# EAGLE design divchrono-master (EAGLE 7.5.0)
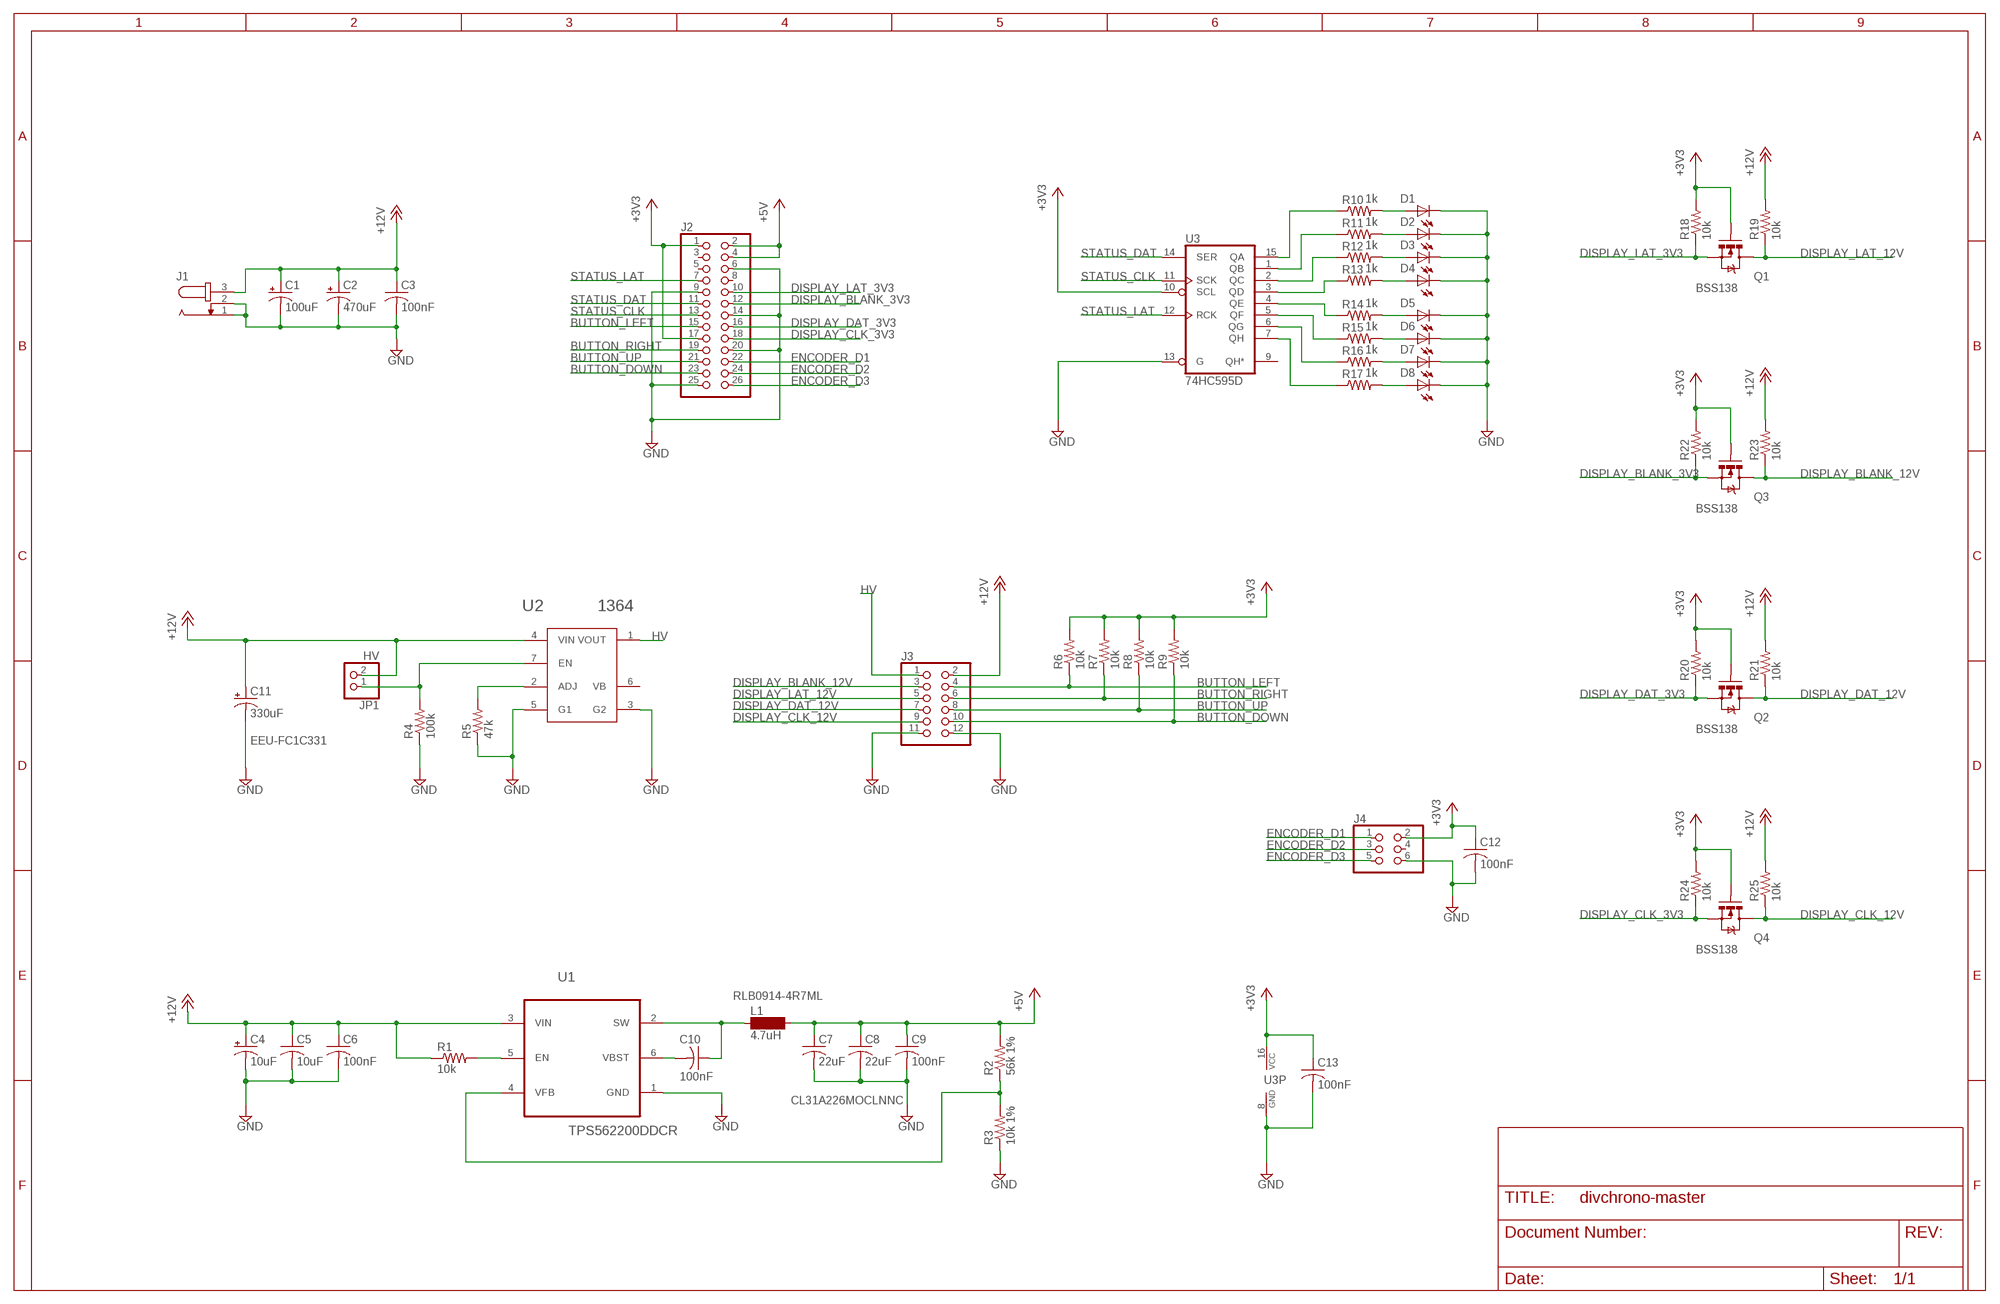
[diagram p0: schematic, sheet 1]

## Parts
C1  100uF  CPOL-USE2.5-6  [E2,5-6]
C2  470uF  CPOL-USE2.5-6  [E2,5-6]
C3  100nF  C-USC1206  [C1206]
C4  10uF  CPOL-USE2-5  [E2-5]
C5  10uF  C-USC1206  [C1206]
C6  100nF  C-USC1206  [C1206]
C7  22uF  C-USC1206  [C1206]
C8  22uF  C-USC1206  [C1206]
C9  100nF  C-USC1206  [C1206]
C10  100nF  C-USC1206  [C1206]
C11  330uF  CPOL-USE3.5-8  [E3,5-8]
C12  100nF  C-USC1206  [C1206]
C13  100nF  C-USC1206  [C1206]
D1  LEDCHIPLED_1206  [CHIPLED_1206]
D2  LEDCHIPLED_1206  [CHIPLED_1206]
D3  LEDCHIPLED_1206  [CHIPLED_1206]
D4  LEDCHIPLED_1206  [CHIPLED_1206]
D5  LEDCHIPLED_1206  [CHIPLED_1206]
D6  LEDCHIPLED_1206  [CHIPLED_1206]
D7  LEDCHIPLED_1206  [CHIPLED_1206]
D8  LEDCHIPLED_1206  [CHIPLED_1206]
J1  JACK-PLUG0  [SPC4077]
J2  PINHD-2X13  [2X13]
J3  PINHD-2X6  [2X06]
J4  PINHD-2X3  [2X03]
JP1  HV  PINHD-1X2  [1X02]
L1  4.7uH  BS11  [BS11]
Q1  BSS138  MOSFET-NCHANNELBSS138  [SOT23-3]
Q2  BSS138  MOSFET-NCHANNELBSS138  [SOT23-3]
Q3  BSS138  MOSFET-NCHANNELBSS138  [SOT23-3]
Q4  BSS138  MOSFET-NCHANNELBSS138  [SOT23-3]
R1  10k  R-US_R1206  [R1206]
R2  56k 1%  R-US_R1206  [R1206]
R3  10k 1%  R-US_R1206  [R1206]
R4  100k  R-US_R1206  [R1206]
R5  47k  R-US_R1206  [R1206]
R6  10k  R-US_R1206  [R1206]
R7  10k  R-US_R1206  [R1206]
R8  10k  R-US_R1206  [R1206]
R9  10k  R-US_R1206  [R1206]
R10  1k  R-US_R1206  [R1206]
R11  1k  R-US_R1206  [R1206]
R12  1k  R-US_R1206  [R1206]
R13  1k  R-US_R1206  [R1206]
R14  1k  R-US_R1206  [R1206]
R15  1k  R-US_R1206  [R1206]
R16  1k  R-US_R1206  [R1206]
R17  1k  R-US_R1206  [R1206]
R18  10k  R-US_R1206  [R1206]
R19  10k  R-US_R1206  [R1206]
R20  10k  R-US_R1206  [R1206]
R21  10k  R-US_R1206  [R1206]
R22  10k  R-US_R1206  [R1206]
R23  10k  R-US_R1206  [R1206]
R24  10k  R-US_R1206  [R1206]
R25  10k  R-US_R1206  [R1206]
U1  TPS562200DDCR  [SOT95P280X110-6N]
U2  1364  [1364]
U3  74HC595D  [SO16]

## Nets
+3V3: C12.1 C13.1 J2.1 J2.17 J4.2 Q1.1(G) Q2.1(G) Q3.1(G) Q4.1(G) R6.2 R7.2 R8.2 R9.2 R18.2 R20.2 R22.2 R24.2 U3.10(SCL) U3.16(VCC)
+5V: C7.1 C8.1 C9.1 J2.2 J2.4 L1.2 R2.2
+12V: C1.+ C2.+ C3.1 C4.+ C5.1 C6.1 C11.+ J1.3 J3.2 JP1.2 R1.1 R19.2 R21.2 R23.2 R25.2 U1.3(VIN) U2.4(VIN)
BUTTON_DOWN: J2.23 J3.10 R9.1
BUTTON_LEFT: J2.15 J3.4 R6.1
BUTTON_RIGHT: J2.19 J3.6 R7.1
BUTTON_UP: J2.21 J3.8 R8.1
DISPLAY_BLANK_3V3: J2.12 Q3.2(S) R22.1
DISPLAY_BLANK_12V: J3.3 Q3.3(D) R23.1
DISPLAY_CLK_3V3: J2.18 Q4.2(S) R24.1
DISPLAY_CLK_12V: J3.9 Q4.3(D) R25.1
DISPLAY_DAT_3V3: J2.16 Q2.2(S) R20.1
DISPLAY_DAT_12V: J3.7 Q2.3(D) R21.1
DISPLAY_LAT_3V3: J2.10 Q1.2(S) R18.1
DISPLAY_LAT_12V: J3.5 Q1.3(D) R19.1
ENCODER_D1: J2.22 J4.1
ENCODER_D2: J2.24 J4.3
ENCODER_D3: J2.26 J4.5
GND: C1.- C2.- C3.2 C4.- C5.2 C6.2 C7.2 C8.2 C9.2 C11.- C12.2 C13.2 D1.C D2.C D3.C D4.C D5.C D6.C D7.C D8.C J1.1 J1.2 J2.6 J2.9 J2.14 J2.20 J2.25 J3.11 J3.12 J4.6 R3.1 R4.1 R5.1 U1.1(GND) U2.3(G2) U2.5(G1) U3.8(GND) U3.13(G)
HV: J3.1 U2.1(VOUT)
N$1: R1.2 U1.5(EN)
N$2: C10.1 L1.1 U1.2(SW)
N$3: JP1.1 R4.2 U2.7(EN)
N$4: R5.2 U2.2(ADJ)
N$5: C10.2 U1.6(VBST)
N$6: R2.1 R3.2 U1.4(VFB)
N$7: R14.1 U3.4(QE)
N$8: R13.1 U3.3(QD)
N$9: R12.1 U3.2(QC)
N$10: D8.A R17.2
N$11: D7.A R16.2
N$12: D6.A R15.2
N$13: D5.A R14.2
N$14: R11.1 U3.1(QB)
N$15: R10.1 U3.15(QA)
N$16: R15.1 U3.5(QF)
N$17: R16.1 U3.6(QG)
N$18: R17.1 U3.7(QH)
N$19: D4.A R13.2
N$20: D3.A R12.2
N$21: D2.A R11.2
N$22: D1.A R10.2
STATUS_CLK: J2.13 U3.11(SCK)
STATUS_DAT: J2.11 U3.14(SER)
STATUS_LAT: J2.7 U3.12(RCK)
Unconnected: J2.3 J2.5 J2.8 J4.4 U2.6(VB) U3.9(QH*)

## Notes on the sheet
- EEU-FC1C331
- RLB0914-4R7ML
- CL31A226MOCLNNC

## Library data of the parts
C1 C2 C4 C11 = rcl:CPOL-US: POLARIZED CAPACITOR, American symbol
C3 C5-C10 C12 C13 = rcl:C-US: CAPACITOR, American symbol
D1-D8 = led:LED: LED OSRAM: - CHIPLED LG R971, LG N971, LY N971, LG Q971, LY Q971, LO R971, LY R971 LH N974, LH R974 LS Q976, LO Q976, LY Q976 LO Q996 - Hyper CHIPLED LW Q18S LB Q993, LB Q99A, LB R99A - SideLED LS A670, LO A670, LY A670, LG A670, LP A670 LB A673, LV A673, LT A673, LW A673 LH A674 LY A675 LS A676, LA A676, LO A676, LY A676, LW A676 LS A679, LY A679, LG A679 - Hyper Micro SIDELED® LS Y876, LA Y876, LO Y876, LY Y876 LT Y87S - SmartLED LW L88C, LW L88S LB L89C, LB L89S, LG L890 LS L89K, LO L89K, LY L89K LS L896, LA L896, LO L896, LY L896 - TOPLED LS T670, LO T670, LY T670, LG T670, LP T670 LSG T670, LSP T670, LSY T670, LOP T670, LYG T670 LG T671, LOG T671, LSG T671 LB T673, LV T673, LT T673, LW T673 LH T674 LS T676, LA T676, LO T676, LY T676, LB T676, LH T676, LSB T676, LW T676 LB T67C, LV T67C, LT T67C, LS T67K, LO T67K, LY T67K, LW E67C LS E67B, LA E67B, LO E67B, LY E67B, LB E67C, LV E67C, LT E67C LW T67C LS T679, LY T679, LG T679 LS T770, LO T770, LY T770, LG T770, LP T770 LB T773, LV T773, LT T773, LW T773 LH T774 LS E675, LA E675, LY E675, LS T675 LS T776, LA T776, LO T776, LY T776, LB T776 LHGB T686 LT T68C, LB T68C - Hyper Mini TOPLED® LB M676 - Mini TOPLED Santana® LG M470 LS M47K, LO M47K, LY M47K Source: http://www.osram.convergy.de LUXEON: - LUMILED® LXK2-PW12-R00, LXK2-PW12-S00, LXK2-PW14-U00, LXK2-PW14-V00 LXK2-PM12-R00, LXK2-PM12-S00, LXK2-PM14-U00 LXK2-PE12-Q00, LXK2-PE12-R00, LXK2-PE12-S00, LXK2-PE14-T00, LXK2-PE14-U00 LXK2-PB12-K00, LXK2-PB12-L00, LXK2-PB12-M00, LXK2-PB14-N00, LXK2-PB14-P00, LXK2-PB14-Q00 LXK2-PR12-L00, LXK2-PR12-M00, LXK2-PR14-Q00, LXK2-PR14-R00 LXK2-PD12-Q00, LXK2-PD12-R00, LXK2-PD12-S00 LXK2-PH12-R00, LXK2-PH12-S00 LXK2-PL12-P00, LXK2-PL12-Q00, LXK2-PL12-R00 Source: www.luxeon.com KINGBRIGHT: KA-3528ASYC Source: www.kingbright.com
J1 = con-jack:JACK-PLUG: DC POWER JACK Power Jack, DC, Right Angle, Through Hole, Rated 5A at 16VDC, PC Terminals Distributor: Farnell (www.Farnell.de) Drawing: 84N1161.pdf / 84N1162.pdf Manufacturer: SPC Technology (www.spctechnology.com) Type: SPC4077 / SPC 4078; OC_FARNELL: unknown; OC_NEWARK: unknown
J2 = pinhead:PINHD-2X13: PIN HEADER
J3 = pinhead:PINHD-2X6: PIN HEADER
J4 = pinhead:PINHD-2X3: PIN HEADER
JP1 = pinhead:PINHD-1X2: PIN HEADER
L1 = inductor-neosid:BS: INDUCTOR nominal inductance, magnetically screened; OC_FARNELL: unknown; OC_NEWARK: unknown
Q1-Q4 = SparkFun-DiscreteSemi:MOSFET-NCHANNEL: Common NMOSFET Parts MFG P/N Store ID Prod ID FDD8780 TRANS-09984 SI7820DN TRANS-11055 FDS6630A IC-08089 2N7002PW TRANS-11151 FQP30N06L COM-10213 TRANS-10060 BSS123LT1G TRANS-08345 BSS138 TRANS-00830 BS170 2N7000; PROD_ID: TRANS-00830; VALUE: 200mA/50V
R1-R25 = rcl:R-US_: RESISTOR, American symbol
U1 = divchrono:TPS562200DDCR
U2 = TES:1364: TES1364 HVPS Horizontal module
U3 = 74xx-eu:74*595: 8-bit SHIFT REGISTER, output latch

## Board
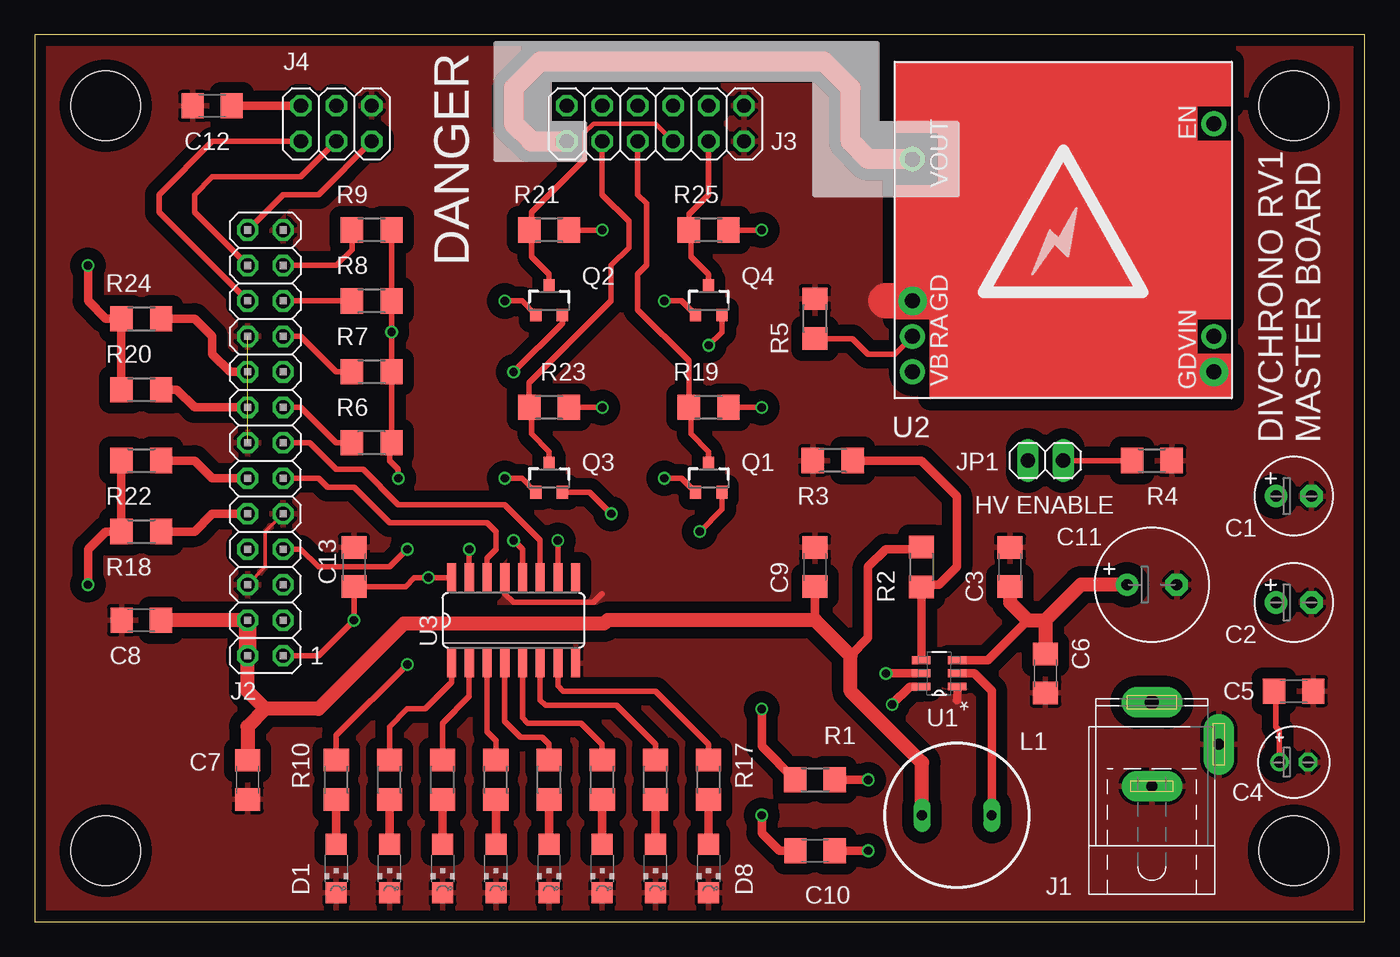
[diagram p1: board, top side]
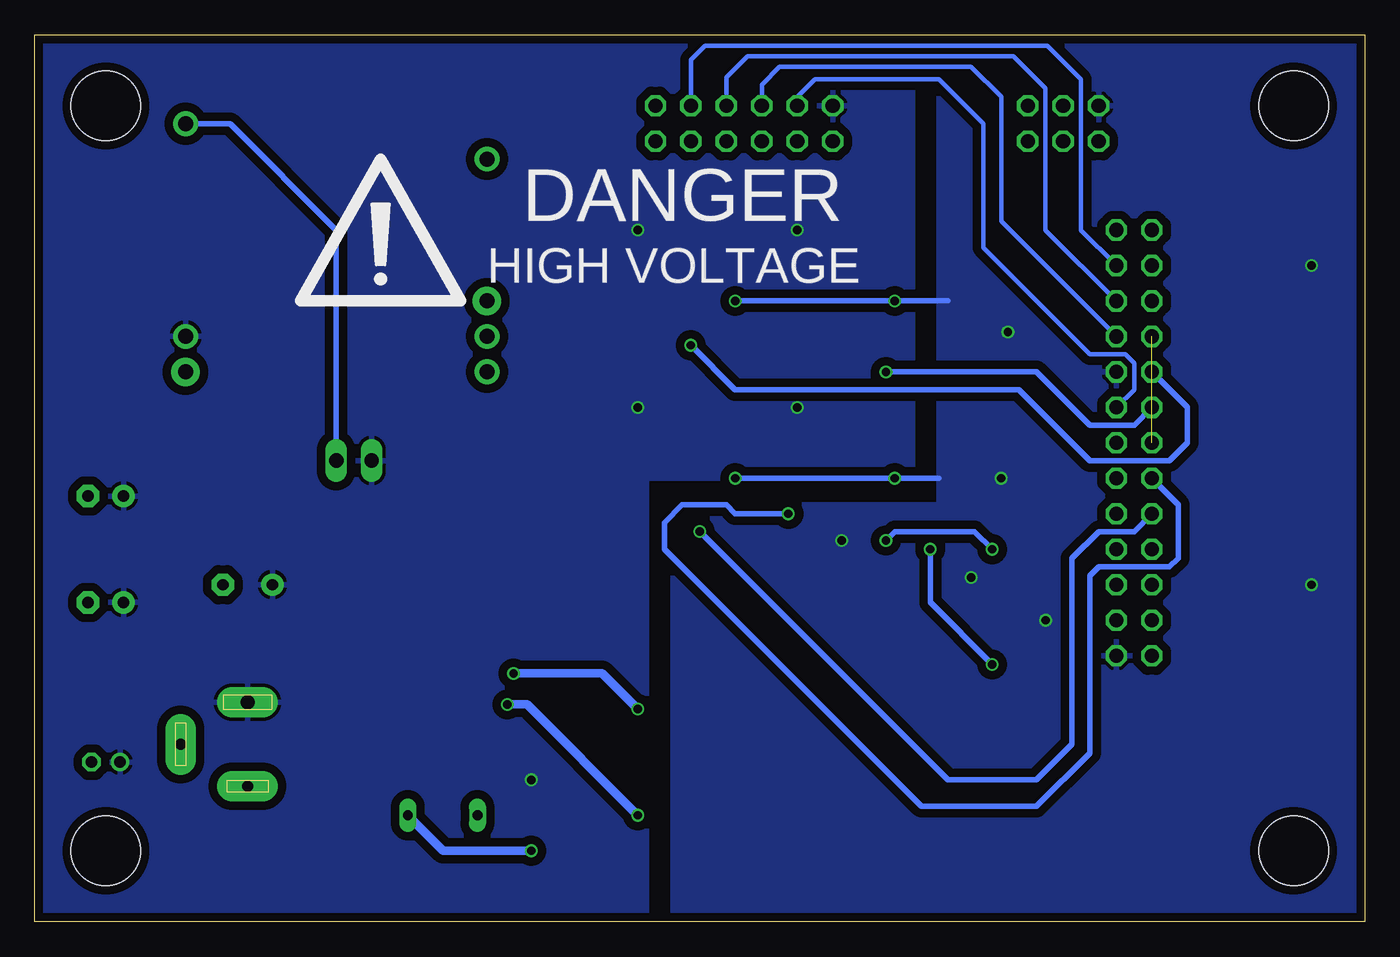
[diagram p2: board, bottom side, seen from below]

Size 95.25 x 63.5 mm. Coordinates in mm from the lower left corner, seen from the top.
Outline: 0,0 95.25,0 95.25,63.5 0,63.5 0,0
Copper layers (1*16): Top 0.035mm / dielectric 1.5mm / Bottom 0.035mm
Design rules "dirt_cheap_dirty_boards.v1 *": minimum track width 5mil, minimum drill 12mil, track to track 12mil, track to pad 12mil, pad to pad 12mil, via to via 12mil, smd to smd 12mil, copper to edge 10mil, drill to drill 10mil, minimum pad ring 10mil, minimum via ring 6mil, stop-mask expansion 2mil, vias tented up to drill 25mil, thermal gap 10mil
Holes 4.98 mm at 5.08,58.42 5.08,5.08 90.17,58.42 90.17,5.08

### Footprints (pad centres in the part's own frame; a part is rotated, then mirrored left to right if it is on the bottom)
E2,5-6 = drill 0.813 pad 1.6: + -1.27,0 | drill 0.813 pad 1.6 octagon: - 1.27,0
C1206 = smd 1.6 x 1.8: 1 -1.4,0; 2 1.4,0
E2-5 = drill 0.813 pad 1.27: + -1.016,0 | drill 0.813 pad 1.27 octagon: - 1.016,0
E3,5-8 = drill 0.813 pad 1.6: + -1.778,0 | drill 0.813 pad 1.6 octagon: - 1.778,0
CHIPLED_1206 = smd 1.5 x 1.5: A 0,-1.75; C 0,1.75
SPC4077 = drill 0.8 pad 2.184 long: 1 -3,0; 2 0,-4.8 | drill 1 pad 2.184 long: 3 3,0
2X13 = drill 1.016 octagon: 1 -15.24,-1.27; 2 -15.24,1.27; 3 -12.7,-1.27; 4 -12.7,1.27; 5 -10.16,-1.27; 6 -10.16,1.27; 7 -7.62,-1.27; 8 -7.62,1.27; 9 -5.08,-1.27; 10 -5.08,1.27; 11 -2.54,-1.27; 12 -2.54,1.27; 13 0,-1.27; 14 0,1.27; 15 2.54,-1.27; 16 2.54,1.27; 17 5.08,-1.27; 18 5.08,1.27; 19 7.62,-1.27; 20 7.62,1.27; 21 10.16,-1.27; 22 10.16,1.27; 23 12.7,-1.27; 24 12.7,1.27; 25 15.24,-1.27; 26 15.24,1.27
2X06 = drill 1.016 octagon: 1 -6.35,-1.27; 2 -6.35,1.27; 3 -3.81,-1.27; 4 -3.81,1.27; 5 -1.27,-1.27; 6 -1.27,1.27; 7 1.27,-1.27; 8 1.27,1.27; 9 3.81,-1.27; 10 3.81,1.27; 11 6.35,-1.27; 12 6.35,1.27
2X03 = drill 1.016 octagon: 1 -2.54,-1.27; 2 -2.54,1.27; 3 0,-1.27; 4 0,1.27; 5 2.54,-1.27; 6 2.54,1.27
1X02 = drill 1.016 long: 1 -1.27,0; 2 1.27,0
BS11 = drill 0.7 long: 1 -2.5,0; 2 2.5,0
SOT23-3 = smd 0.8 x 0.9: 1 -0.95,-1; 2 0.95,-1; 3 0,1.1
R1206 = smd 1.6 x 1.803: 1 -1.422,0; 2 1.422,0
SOT95P280X110-6N = smd 1.321 x 0.559: 1 -1.295,0.94; 2 -1.295,0; 3 -1.295,-0.94; 4 1.295,-0.94; 5 1.295,0; 6 1.295,0.94
1364 = drill 1.067 pad 1.778: 1 5.08,10.795; 2 -7.62,10.795; 4 -7.62,-10.795; 6 -10.16,10.795; 7 7.62,-10.795 | drill 1.067 pad 2.032: 3 -5.08,10.795; 5 -10.16,-10.795
SO16 = smd 0.66 x 2.032: 1 -4.445,-3.073; 2 -3.175,-3.073; 3 -1.905,-3.073; 4 -0.635,-3.073; 5 0.635,-3.073; 6 1.905,-3.073; 7 3.175,-3.073; 8 4.445,-3.073; 9 4.445,3.073; 10 3.175,3.073; 11 1.905,3.073; 12 0.635,3.073; 13 -0.635,3.073; 14 -1.905,3.073; 15 -3.175,3.073; 16 -4.445,3.073

### Placement (x,y rotation side)
C1  90.17,30.48 0 top
C2  90.17,22.86 0 top
C3  69.85,25.4 90 top
C4  90.17,11.43 0 top
C5  90.17,16.51 0 top
C6  72.39,17.78 270 top
C7  15.24,10.16 270 top
C8  7.62,21.59 180 top
C9  55.88,25.4 90 top
C10  55.88,5.08 180 top
C11  80.01,24.13 0 top
C12  12.7,58.42 180 top
C13  22.86,25.4 90 top
D1  21.59,3.81 180 top
D2  25.4,3.81 180 top
D3  29.21,3.81 180 top
D4  33.02,3.81 180 top
D5  36.83,3.81 180 top
D6  40.64,3.81 180 top
D7  44.45,3.81 180 top
D8  48.26,3.81 180 top
J1  80.01,12.7 90 top
J2  16.51,34.29 90 top
J3  44.45,57.15 0 top
J4  21.59,57.15 0 top
JP1  72.39,33.02 180 top
L1  66.04,7.62 180 top
Q1  48.26,31.75 0 top
Q2  36.83,44.45 0 top
Q3  36.83,31.75 0 top
Q4  48.26,44.45 0 top
R1  55.88,10.16 180 top
R2  63.5,25.4 90 top
R3  57.15,33.02 0 top
R4  80.01,33.02 180 top
R5  55.88,43.18 270 top
R6  24.13,34.29 0 top
R7  24.13,39.37 0 top
R8  24.13,44.45 0 top
R9  24.13,49.53 0 top
R10  21.59,10.16 270 top
R11  25.4,10.16 270 top
R12  29.21,10.16 270 top
R13  33.02,10.16 270 top
R14  36.83,10.16 270 top
R15  40.64,10.16 270 top
R16  44.45,10.16 270 top
R17  48.26,10.16 270 top
R18  7.62,27.94 180 top
R19  48.26,36.83 0 top
R20  7.62,38.1 180 top
R21  36.83,49.53 0 top
R22  7.62,33.02 180 top
R23  36.83,36.83 0 top
R24  7.62,43.18 180 top
R25  48.26,49.53 0 top
U1  64.77,17.78 180 top
U2  73.66,49.53 90 top
U3  34.29,21.59 0 top
U$1  [ICON_DANGER]  70.48,48.9 0 bottom
U$2  [ICON_BOLT-L]  73.66,49.53 0 top

### Tracks (layer width: path | path; a pad name or v marks a point on that pad's centre or on a via)
+3V3  (via drill 0.6)
  Top 0.406: J2.1 20.32,19.05 v22.86,21.59 C13.1 26.54,24 27.18,24.64 v28.19,24.64 29.82,24.64 U3.16 | R8.2 R9.2 | v33.66,31.75 34.88,31.75 Q3.1 | v33.66,44.45 34.88,44.45 Q2.1 | v45.09,44.45 46.31,44.45 Q4.1 | v45.09,31.75 46.31,31.75 Q1.1 | v26.04,31.75 26.04,32.38 25.4,33.02 25.4,34.14 R6.2 R7.2 v25.55,42.21 v25.55,42.22 R8.2 | U3.10 v37.47,27.3 | R8.2
  Top 0.61: R20.2 R24.2 5.08,43.18 3.81,44.45 v3.81,46.99 | R22.2 R18.2 5.08,27.94 3.81,26.67 v3.81,24.13 | C12.1 J4.2
  Bottom 0.406: 29.84,44.45 v33.66,44.45 v45.09,44.45 | 30.48,31.75 v33.66,31.75 v45.09,31.75
  pour Bottom (isolate 0.61): 0,63.5 30.48,63.5 30.48,29.84 49.53,29.84 49.53,0 0,0
+5V
  Top 0.61: 55.88,21.59 C9.1 | 58.42,19.05 59.69,20.32 59.69,25.4 60.96,26.67 63.35,26.67 R2.2
  Top 1.016: L1.2 63.54,11.39 58.42,16.51 58.42,19.05 55.88,21.59 41.02,21.59 40.77,21.34 26.42,21.34 20.32,15.24 16.51,15.24 | 16.51,15.24 15.24,16.51 J2.2 | 16.51,15.24 15.24,13.97 C7.1 | J2.4 C8.1
  Top 1.27: J2.2 J2.4
+12V  (via drill 0.6)
  Top 0.406: C4.+ 89.15,13.72 88.9,13.97 88.9,16.38 C5.1 | v52.07,36.83 R19.2 | v40.64,36.83 R23.2 38.1,36.83 | R21.2 v40.64,49.53 | R25.2 v52.07,49.53
  Top 0.61: U1.3 68.25,18.72 71.12,21.59 | R1.1 v59.69,10.16
  Top 1.016: C11.+ 74.93,24.13 72.39,21.59 | 72.39,21.59 C6.1 | C3.1 69.85,22.86 71.12,21.59 72.39,21.59
  pour Bottom (isolate 0.61): 95.25,63.5 95.25,0 51.44,0 51.44,29.84 51.44,31.75 33.66,31.75 32.38,31.75 32.38,35.56 32.38,63.5
BUTTON_DOWN
  Top 0.406: R9.1 22.71,48.11 21.59,46.99 J2.23
  Bottom 0.305: J3.10 48.26,61.72 47.24,62.74 22.73,62.74 20.32,60.33 20.32,49.53 J2.23
BUTTON_LEFT
  Top 0.406: R6.1 21.59,34.29 19.05,36.83 J2.15
  Bottom 0.305: J3.4 40.64,59.05 39.37,60.33 30.48,60.33 27.3,57.15 27.3,48.26 19.68,40.64 17.14,40.64 16.51,40.01 16.51,38.1 J2.15
BUTTON_RIGHT
  Top 0.406: J2.19 19.05,41.91 21.59,39.37 R7.1
  Bottom 0.305: J3.6 43.18,59.94 41.91,61.21 28.19,61.21 26.04,59.05 26.04,50.16 J2.19
BUTTON_UP
  Top 0.406: R8.1 J2.21
  Bottom 0.305: J3.8 45.72,60.45 44.2,61.98 25.15,61.98 22.86,59.69 22.86,49.53 J2.21
DISPLAY_BLANK_3V3  (via drill 0.6)
  Top 0.406: Q3.2 39.73,30.75 v41.27,29.21
  Top 0.61: R22.1 11.43,33.02 12.7,31.75 J2.12
  Bottom 0.406: v41.27,29.21 45.09,29.21 45.72,29.84 48.9,29.84 50.16,28.57 50.16,26.67 31.75,8.26 23.5,8.26 19.68,12.06 19.68,24.77 19.05,25.4 13.97,25.4 13.34,26.04 13.34,29.84 J2.12
DISPLAY_BLANK_12V
  Top 0.406: Q3.3 36.83,33.66 35.56,34.92 35.56,36.68 R23.1 35.41,38.58 41.27,44.45 41.27,46.99 42.55,48.26 42.55,50.16 40.64,52.07 J3.3
DISPLAY_CLK_3V3  (via drill 0.6)
  Top 0.406: Q4.2 49.21,42.23 v48.26,41.27
  Top 0.61: R24.1 11.43,43.18 12.7,41.91 12.7,40.64 13.97,39.37 J2.18
  Bottom 0.406: v48.26,41.27 45.09,38.1 24.77,38.1 19.68,33.02 13.97,33.02 12.7,34.29 12.7,36.83 J2.18
DISPLAY_CLK_12V
  Top 0.406: Q4.3 48.26,46.35 46.99,47.62 46.99,49.38 R25.1 46.84,50.65 48.26,52.07 J3.9
DISPLAY_DAT_3V3  (via drill 0.6)
  Top 0.406: Q2.2 37.78,42.86 v34.29,39.37
  Top 0.61: R20.1 10.16,38.1 11.43,36.83 J2.16
  Bottom 0.406: v34.29,39.37 23.5,39.37 19.68,35.56 16.51,35.56 J2.16
DISPLAY_DAT_12V
  Top 0.305: 39.37,54.61 39.37,56.52 40.01,57.15 44.45,57.15 J3.7
  Top 0.406: Q2.3 36.83,46.35 35.56,47.62 35.56,49.38 | 35.56,49.38 R21.1 | 35.56,49.38 35.56,50.8 39.37,54.61
DISPLAY_LAT_3V3  (via drill 0.6)
  Top 0.406: Q1.2 49.21,29.52 v47.62,27.94
  Top 0.61: R18.1 11.43,27.94 12.7,29.21 J2.10
  Bottom 0.406: v47.62,27.94 29.84,10.16 23.5,10.16 20.95,12.7 20.95,26.04 19.05,27.94 16.51,27.94 J2.10
DISPLAY_LAT_12V
  Top 0.406: Q1.3 48.26,33.66 46.99,34.92 46.99,36.68 R19.1 46.84,40.16 43.18,43.81 43.18,46.35 43.81,46.99 43.81,51.44 43.18,52.07 J3.5
ENCODER_D1
  Top 0.406: J2.22 8.89,50.8 8.89,52.07 12.7,55.88 J4.1
ENCODER_D2
  Top 0.406: J4.3 19.05,53.34 12.7,53.34 11.43,52.07 11.43,50.8 J2.24
ENCODER_D3
  Top 0.406: J4.5 20.32,52.07 17.78,52.07 J2.26
GND  (1 unrouted)
  Top 0.254: J2.6 16.51,25.4 16.51,27.94 J2.9
  Top 0.406: U3.13 33.66,23.5 34.29,22.86 40.01,22.86 40.64,23.5
  Top 0.61: U1.1 66.06,15.9 66.04,15.88
  Top 2.54: U2.3 60.96,44.45
  pour Top (isolate 0.813): 0,63.5 95.25,63.5 95.25,0 0,0
HV
  Top 1.422: U2.1 59.69,54.61 58.42,55.88 58.42,59.69 56.52,61.59 36.2,61.59 34.29,59.69 34.29,57.15 35.56,55.88 J3.1
N$1  (via drill 0.6)
  Top 0.61: U1.5 v60.96,17.78 | v52.07,15.24 52.07,12.55 R1.2
  Bottom 0.61: v60.96,17.78 54.61,17.78 v52.07,15.24
N$2  (via drill 0.6)
  Top 0.61: L1.1 68.54,16.55 67.31,17.78 U1.2 | C10.1 v59.69,5.08
  Bottom 0.61: v59.69,5.08 66,5.08 L1.1
N$3
  Top 0.406: JP1.1 R4.2
  Bottom 0.406: U2.7 81.28,57.15 73.66,49.53 JP1.1
N$4
  Top 0.406: R5.2 58.57,41.76 59.69,40.64 61.59,40.64 U2.2
N$5  (via drill 0.6)
  Top 0.61: U1.6 62.69,16.84 v61.4,15.56 | v52.07,7.62 52.07,6.35 53.34,5.08 C10.2
  Bottom 0.61: v61.4,15.56 60.01,15.56 v52.07,7.62
N$6
  Top 0.61: 63.46,18.73 U1.4 63.5,18.75 R2.1 63.65,24.13 64.77,24.13 66.04,25.4 66.04,30.48 63.5,33.02 R3.2
N$7
  Top 0.406: U3.4 33.66,14.35 34.8,13.21 36.32,13.21 36.83,12.7 R14.1
N$8
  Top 0.406: U3.3 32.38,13.59 33.02,12.95 R13.1
N$9
  Top 0.406: U3.2 31.11,16.13 29.21,14.22 R12.1
N$10
  Top 0.61: R17.2 D8.A
N$11
  Top 0.61: R16.2 D7.A
N$12
  Top 0.61: R15.2 D6.A
N$13
  Top 0.61: R14.2 D5.A
N$14
  Top 0.406: U3.1 29.84,17.14 27.94,15.24 26.67,15.24 25.4,13.97 R11.1
N$15  (via drill 0.6)
  Top 0.406: U3.15 v31.11,26.67 | v26.67,18.41 21.59,13.34 R10.1
  Bottom 0.406: v31.11,26.67 31.11,22.86 v26.67,18.41
N$16
  Top 0.406: U3.5 34.92,14.61 35.31,14.22 39.12,14.22 40.64,12.7 R15.1
N$17
  Top 0.406: U3.6 36.2,15.88 36.58,15.49 41.66,15.49 44.45,12.7 R16.1
N$18
  Top 0.406: U3.7 37.47,16.89 37.85,16.51 44.45,16.51 48.26,12.7 R17.1
N$19
  Top 0.61: R13.2 D4.A
N$20
  Top 0.61: R12.2 D3.A
N$21
  Top 0.61: R11.2 D2.A
N$22
  Top 0.61: R10.2 D1.A
STATUS_CLK
  Top 0.406: U3.11 36.2,27.3 33.66,29.84 26.04,29.84 23.5,32.38 21.59,32.38 19.68,34.29 J2.13
STATUS_DAT
  Top 0.406: U3.14 32.38,26.04 33.02,26.67 33.02,27.94 32.38,28.57 25.4,28.57 22.86,31.11 20.95,31.11 20.32,31.75 J2.11
STATUS_LAT  (via drill 0.6)
  Top 0.406: J2.7 19.05,26.67 20.32,25.4 25.4,25.4 v26.67,26.67 | v34.29,27.3 34.92,26.67 U3.12
  Bottom 0.406: v26.67,26.67 27.94,27.94 33.66,27.94 v34.29,27.3

### Text on the board
tPlace: DANGER | DIVCHRONO RV1 / MASTER BOARD | HV ENABLE | 1